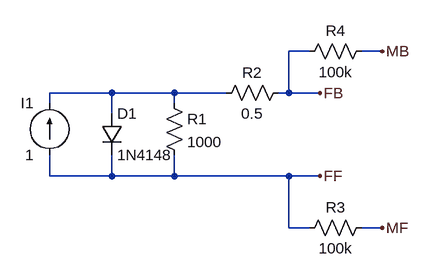
[diagram p0: schematic Solar_cell_4_wire.asc]
Solar_cell_4_wire.asc, the LTspice schematic file:
Version 4
SHEET 1 880 680
WIRE 416 32 384 32
WIRE 528 32 496 32
WIRE 112 96 16 96
WIRE 208 96 112 96
WIRE 288 96 208 96
WIRE 384 96 384 32
WIRE 384 96 368 96
WIRE 432 96 384 96
WIRE 16 112 16 96
WIRE 208 112 208 96
WIRE 112 128 112 96
WIRE 16 224 16 192
WIRE 112 224 112 192
WIRE 112 224 16 224
WIRE 208 224 208 192
WIRE 208 224 112 224
WIRE 384 224 208 224
WIRE 432 224 384 224
WIRE 384 304 384 224
WIRE 416 304 384 304
WIRE 528 304 496 304
FLAG 432 96 FB
FLAG 432 224 FF
FLAG 528 32 MB
FLAG 528 304 MF
SYMBOL current 16 192 R180
WINDOW 0 24 80 Left 2
WINDOW 3 24 0 Left 2
WINDOW 123 0 0 Left 0
WINDOW 39 0 0 Left 0
SYMATTR InstName I1
SYMATTR Value 1
SYMBOL diode 96 128 R0
SYMATTR InstName D1
SYMATTR Value 1N4148
SYMBOL res 192 96 R0
SYMATTR InstName R1
SYMATTR Value 1000
SYMBOL res 384 80 R90
WINDOW 0 0 56 VBottom 2
WINDOW 3 32 56 VTop 2
SYMATTR InstName R2
SYMATTR Value 0.5
SYMBOL res 512 288 R90
WINDOW 0 0 56 VBottom 2
WINDOW 3 32 56 VTop 2
SYMATTR InstName R3
SYMATTR Value 100k
SYMBOL res 512 16 R90
WINDOW 0 0 56 VBottom 2
WINDOW 3 32 56 VTop 2
SYMATTR InstName R4
SYMATTR Value 100k

The netlist it stands for:
* Solar_cell_4_wire.asc
I1 FF N001 1
D1 N001 FF 1N4148
R1 N001 FF 1000
R2 FB N001 0.5
R3 MF FF 100k
R4 MB FB 100k
.model D D
.lib standard.dio
.backanno
.end